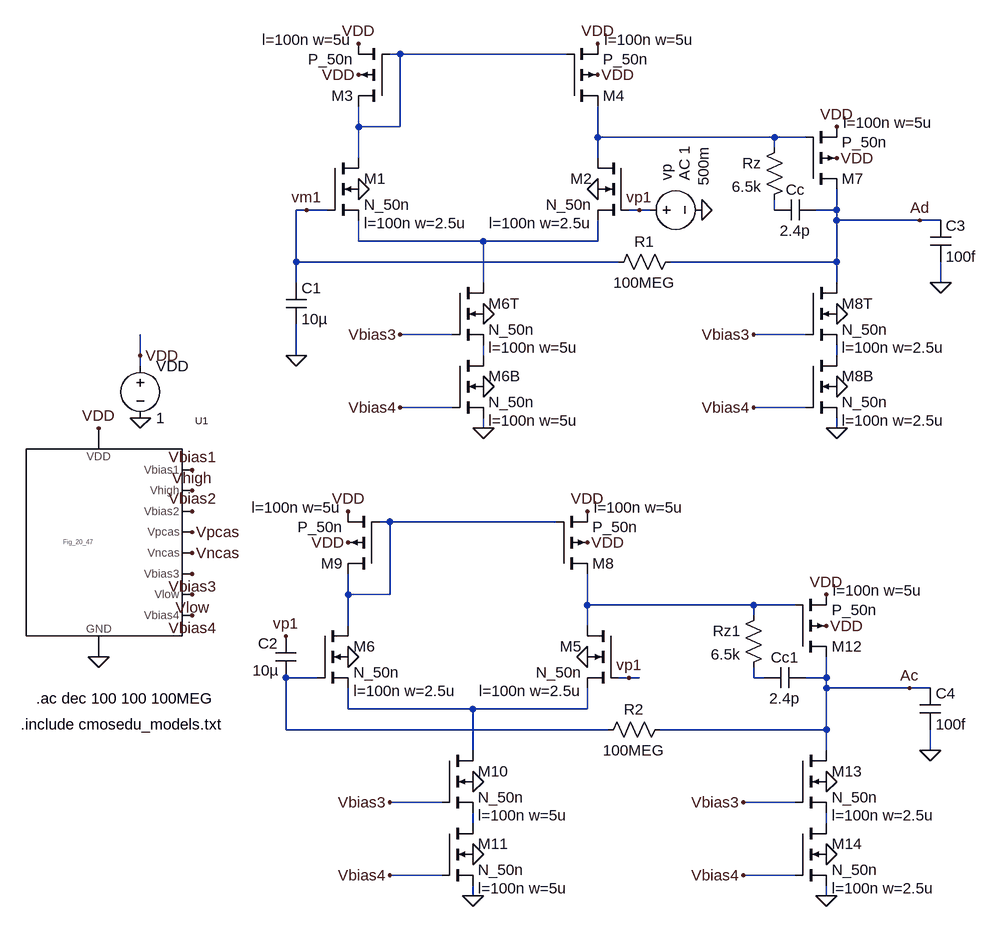
[diagram p0: schematic Fig24_25_CMRR.asc]
Fig24_25_CMRR.asc, the LTspice schematic file:
Version 4
SHEET 1 2160 680
WIRE 1264 -816 1248 -816
WIRE 1520 -816 1264 -816
WIRE 1200 -704 1200 -736
WIRE 1264 -704 1264 -816
WIRE 1264 -704 1200 -704
WIRE 1568 -688 1568 -736
WIRE 1840 -688 1568 -688
WIRE 1888 -688 1840 -688
WIRE 1840 -672 1840 -688
WIRE 1200 -656 1200 -704
WIRE 1568 -656 1568 -688
WIRE 1120 -576 1104 -576
WIRE 1152 -576 1120 -576
WIRE 1632 -576 1616 -576
WIRE 1648 -576 1632 -576
WIRE 1840 -576 1840 -592
WIRE 1936 -576 1936 -608
WIRE 1936 -576 1904 -576
WIRE 1936 -560 1936 -576
WIRE 2064 -560 1936 -560
WIRE 2096 -560 2064 -560
WIRE 1200 -528 1200 -560
WIRE 1392 -528 1200 -528
WIRE 1568 -528 1568 -560
WIRE 1568 -528 1392 -528
WIRE 1104 -496 1104 -576
WIRE 1600 -496 1104 -496
WIRE 1936 -496 1936 -560
WIRE 1936 -496 1680 -496
WIRE 1104 -464 1104 -496
WIRE 1392 -464 1392 -528
WIRE 1936 -464 1936 -496
WIRE 2096 -464 2096 -496
WIRE 1344 -384 1264 -384
WIRE 1888 -384 1808 -384
WIRE 864 -352 864 -384
WIRE 1104 -352 1104 -400
WIRE 1392 -352 1392 -368
WIRE 1936 -352 1936 -368
WIRE 864 -336 864 -352
WIRE 1344 -272 1264 -272
WIRE 1888 -272 1808 -272
WIRE 1392 -240 1392 -256
WIRE 1936 -240 1936 -256
WIRE 1248 -96 1232 -96
WIRE 1504 -96 1248 -96
WIRE 1184 16 1184 -16
WIRE 1248 16 1248 -96
WIRE 1248 16 1184 16
WIRE 1552 32 1552 -16
WIRE 1808 32 1552 32
WIRE 1872 32 1808 32
WIRE 1808 48 1808 32
WIRE 1184 64 1184 16
WIRE 1552 64 1552 32
WIRE 1136 144 1088 144
WIRE 1616 144 1600 144
WIRE 1632 144 1616 144
WIRE 1808 144 1808 128
WIRE 1824 144 1808 144
WIRE 1920 144 1920 112
WIRE 1920 144 1888 144
WIRE 1920 160 1920 144
WIRE 2048 160 1920 160
WIRE 2080 160 2048 160
WIRE 1184 192 1184 160
WIRE 1376 192 1184 192
WIRE 1552 192 1552 160
WIRE 1552 192 1376 192
WIRE 1088 224 1088 144
WIRE 1584 224 1088 224
WIRE 1920 224 1920 160
WIRE 1920 224 1664 224
WIRE 1376 256 1376 192
WIRE 1920 256 1920 224
WIRE 2080 256 2080 224
WIRE 1328 336 1248 336
WIRE 1872 336 1792 336
WIRE 1376 368 1376 352
WIRE 1920 368 1920 352
WIRE 1328 448 1248 448
WIRE 1872 448 1792 448
WIRE 1376 480 1376 464
WIRE 1920 480 1920 464
FLAG 864 -256 0
FLAG 864 -352 VDD
FLAG 1568 -608 0
FLAG 1392 -240 0
FLAG 1200 -608 0
FLAG 1568 -832 VDD
FLAG 1568 -784 VDD
FLAG 1200 -784 VDD
FLAG 800 -240 VDD
FLAG 800 112 0
FLAG 944 -176 Vbias1
FLAG 944 -144 Vhigh
FLAG 944 -112 Vbias2
FLAG 944 -16 Vbias3
FLAG 944 -80 Vpcas
FLAG 944 -48 Vncas
FLAG 944 48 Vbias4
FLAG 944 16 Vlow
FLAG 1200 -832 VDD
FLAG 1392 -416 0
FLAG 1392 -304 0
FLAG 1264 -384 Vbias3
FLAG 1264 -272 Vbias4
FLAG 1728 -576 0
FLAG 1120 -576 vm1
FLAG 1632 -576 vp1
FLAG 1936 -704 VDD
FLAG 1936 -656 VDD
FLAG 1936 -240 0
FLAG 1936 -416 0
FLAG 1936 -304 0
FLAG 1808 -384 Vbias3
FLAG 1808 -272 Vbias4
FLAG 2064 -560 Ad
FLAG 1104 -352 0
FLAG 2096 -464 0
FLAG 1552 112 0
FLAG 1376 480 0
FLAG 1184 112 0
FLAG 1552 -112 VDD
FLAG 1552 -64 VDD
FLAG 1184 -64 VDD
FLAG 1184 -112 VDD
FLAG 1376 304 0
FLAG 1376 416 0
FLAG 1248 336 Vbias3
FLAG 1248 448 Vbias4
FLAG 1616 144 vp1
FLAG 1920 16 VDD
FLAG 1920 64 VDD
FLAG 1920 480 0
FLAG 1920 304 0
FLAG 1920 416 0
FLAG 1792 336 Vbias3
FLAG 1792 448 Vbias4
FLAG 2048 160 Ac
FLAG 2080 256 0
FLAG 1088 80 vp1
SYMBOL voltage 864 -352 R0
WINDOW 123 0 0 Left 2
WINDOW 39 0 0 Left 2
SYMATTR InstName VDD
SYMATTR Value 1
SYMBOL nmos4 1616 -656 M0
WINDOW 123 56 100 Left 2
SYMATTR Value2 l=100n w=2.5u
SYMATTR InstName M2
SYMATTR Value N_50n
SYMBOL nmos4 1152 -656 R0
WINDOW 123 56 100 Left 2
SYMATTR Value2 l=100n w=2.5u
SYMATTR InstName M1
SYMATTR Value N_50n
SYMBOL pmos4 1520 -736 M180
WINDOW 123 58 102 Left 2
WINDOW 0 56 16 Left 2
SYMATTR Value2 l=100n w=5u
SYMATTR InstName M4
SYMATTR Value P_50n
SYMBOL pmos4 1248 -736 R180
WINDOW 123 58 102 Left 2
WINDOW 0 56 16 Left 2
SYMATTR Value2 l=100n w=5u
SYMATTR InstName M3
SYMATTR Value P_50n
SYMBOL Fig_20_47 800 -64 R0
SYMATTR InstName U1
SYMBOL nmos4 1344 -464 R0
WINDOW 123 56 100 Left 2
SYMATTR Value2 l=100n w=5u
SYMATTR InstName M6T
SYMATTR Value N_50n
SYMBOL nmos4 1344 -352 R0
WINDOW 123 56 100 Left 2
SYMATTR Value2 l=100n w=5u
SYMATTR InstName M6B
SYMATTR Value N_50n
SYMBOL voltage 1632 -576 R270
WINDOW 0 45 42 Left 2
WINDOW 3 37 99 Left 2
WINDOW 123 45 70 Left 2
WINDOW 39 0 0 Left 2
SYMATTR InstName vp
SYMATTR Value 500m
SYMATTR Value2 AC 1
SYMBOL pmos4 1888 -608 M180
WINDOW 123 58 102 Left 2
WINDOW 0 56 16 Left 2
SYMATTR Value2 l=100n w=5u
SYMATTR InstName M7
SYMATTR Value P_50n
SYMBOL nmos4 1888 -464 R0
WINDOW 123 56 100 Left 2
SYMATTR Value2 l=100n w=2.5u
SYMATTR InstName M8T
SYMATTR Value N_50n
SYMBOL nmos4 1888 -352 R0
WINDOW 123 56 100 Left 2
SYMATTR Value2 l=100n w=2.5u
SYMATTR InstName M8B
SYMATTR Value N_50n
SYMBOL cap 1088 -464 R0
SYMATTR InstName C1
SYMATTR Value 10µ
SYMBOL res 1584 -480 R270
WINDOW 0 32 56 VTop 2
WINDOW 3 0 56 VBottom 2
SYMATTR InstName R1
SYMATTR Value 100MEG
SYMBOL cap 1904 -592 R90
WINDOW 0 0 32 VBottom 2
WINDOW 3 32 32 VTop 2
SYMATTR InstName Cc
SYMATTR Value 2.4p
SYMBOL cap 2080 -560 R0
SYMATTR InstName C3
SYMATTR Value 100f
SYMBOL res 1856 -688 M0
SYMATTR InstName Rz
SYMATTR Value 6.5k
SYMBOL nmos4 1600 64 M0
WINDOW 123 56 100 Left 2
SYMATTR Value2 l=100n w=2.5u
SYMATTR InstName M5
SYMATTR Value N_50n
SYMBOL nmos4 1136 64 R0
WINDOW 123 56 100 Left 2
SYMATTR Value2 l=100n w=2.5u
SYMATTR InstName M6
SYMATTR Value N_50n
SYMBOL pmos4 1504 -16 M180
WINDOW 123 58 102 Left 2
WINDOW 0 56 16 Left 2
SYMATTR Value2 l=100n w=5u
SYMATTR InstName M8
SYMATTR Value P_50n
SYMBOL pmos4 1232 -16 R180
WINDOW 123 58 102 Left 2
WINDOW 0 56 16 Left 2
SYMATTR Value2 l=100n w=5u
SYMATTR InstName M9
SYMATTR Value P_50n
SYMBOL nmos4 1328 256 R0
WINDOW 123 56 100 Left 2
SYMATTR Value2 l=100n w=5u
SYMATTR InstName M10
SYMATTR Value N_50n
SYMBOL nmos4 1328 368 R0
WINDOW 123 56 100 Left 2
SYMATTR Value2 l=100n w=5u
SYMATTR InstName M11
SYMATTR Value N_50n
SYMBOL pmos4 1872 112 M180
WINDOW 123 58 102 Left 2
WINDOW 0 56 16 Left 2
SYMATTR Value2 l=100n w=5u
SYMATTR InstName M12
SYMATTR Value P_50n
SYMBOL nmos4 1872 256 R0
WINDOW 123 56 100 Left 2
SYMATTR Value2 l=100n w=2.5u
SYMATTR InstName M13
SYMATTR Value N_50n
SYMBOL nmos4 1872 368 R0
WINDOW 123 56 100 Left 2
SYMATTR Value2 l=100n w=2.5u
SYMATTR InstName M14
SYMATTR Value N_50n
SYMBOL res 1568 240 R270
WINDOW 0 32 56 VTop 2
WINDOW 3 0 56 VBottom 2
SYMATTR InstName R2
SYMATTR Value 100MEG
SYMBOL cap 1888 128 R90
WINDOW 0 0 32 VBottom 2
WINDOW 3 32 32 VTop 2
SYMATTR InstName Cc1
SYMATTR Value 2.4p
SYMBOL cap 2064 160 R0
SYMATTR InstName C4
SYMATTR Value 100f
SYMBOL res 1824 32 M0
SYMATTR InstName Rz1
SYMATTR Value 6.5k
SYMBOL cap 1072 80 R0
WINDOW 0 -27 11 Left 2
WINDOW 3 -35 53 Left 2
SYMATTR InstName C2
SYMATTR Value 10µ
TEXT 680 216 Left 2 !.include cmosedu_models.txt
TEXT 704 176 Left 2 !.ac dec 100 100 100MEG

The netlist it stands for:
* Fig24_25_CMRR.asc
VDD VDD 0 1
M2 N002 vp1 N004 0 N_50n l=100n w=2.5u
M1 N001 vm1 N004 0 N_50n l=100n w=2.5u
M4 N002 N001 VDD VDD P_50n l=100n w=5u
M3 N001 N001 VDD VDD P_50n l=100n w=5u
XU1 Vbias1 Vhigh Vbias2 Vpcas Vncas Vbias3 Vlow Vbias4 VDD 0 Fig_20_47  ; pins Vbias1 Vhigh Vbias2 Vpcas Vncas Vbias3 Vlow Vbias4 VDD GND
M6T N004 Vbias3 N005 0 N_50n l=100n w=5u
M6B N005 Vbias4 0 0 N_50n l=100n w=5u
vp vp1 0 500m AC 1
M7 Ad N002 VDD VDD P_50n l=100n w=5u
M8T Ad Vbias3 N006 0 N_50n l=100n w=2.5u
M8B N006 Vbias4 0 0 N_50n l=100n w=2.5u
C1 vm1 0 10µ
R1 vm1 Ad 100MEG
Cc Ad N003 2.4p
C3 Ad 0 100f
Rz N002 N003 6.5k
M5 N008 vp1 N011 0 N_50n l=100n w=2.5u
M6 N007 N009 N011 0 N_50n l=100n w=2.5u
M8 N008 N007 VDD VDD P_50n l=100n w=5u
M9 N007 N007 VDD VDD P_50n l=100n w=5u
M10 N011 Vbias3 N012 0 N_50n l=100n w=5u
M11 N012 Vbias4 0 0 N_50n l=100n w=5u
M12 Ac N008 VDD VDD P_50n l=100n w=5u
M13 Ac Vbias3 N013 0 N_50n l=100n w=2.5u
M14 N013 Vbias4 0 0 N_50n l=100n w=2.5u
R2 N009 Ac 100MEG
Cc1 Ac N010 2.4p
C4 Ac 0 100f
Rz1 N008 N010 6.5k
C2 vp1 N009 10µ
.model NMOS NMOS
.model PMOS PMOS
.lib standard.mos
.include cmosedu_models.txt
.ac dec 100 100 100MEG
.backanno
.end